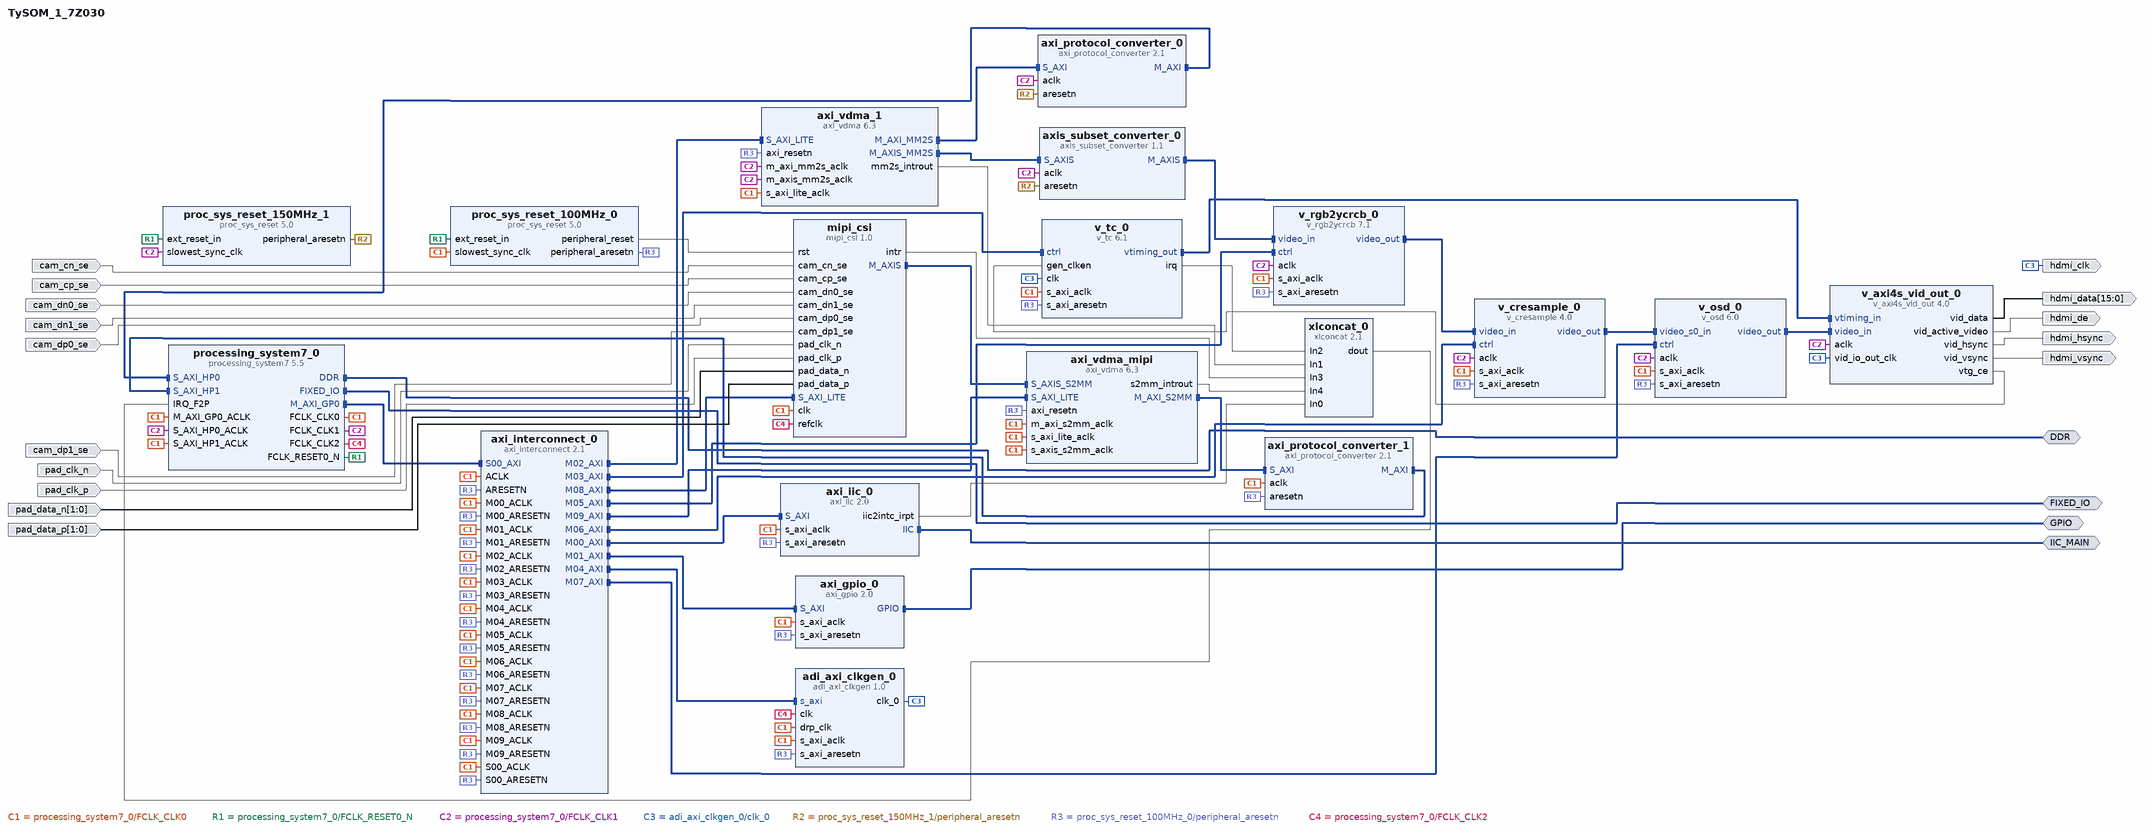
[diagram p0: block diagram of the top level]
# Vivado block design TySOM_1_7Z030, xc7z030fbg484-1, Vivado 2017.4
create_bd_design TySOM_1_7Z030

create_bd_intf_port -mode Master -vlnv xilinx.com:interface:ddrx_rtl:1.0 DDR
create_bd_intf_port -mode Master -vlnv xilinx.com:display_processing_system7:fixedio_rtl:1.0 FIXED_IO
create_bd_intf_port -mode Master -vlnv xilinx.com:interface:gpio_rtl:1.0 GPIO
create_bd_intf_port -mode Master -vlnv xilinx.com:interface:iic_rtl:1.0 IIC_MAIN
create_bd_port -dir O hdmi_clk
create_bd_port -dir I cam_cn_se
create_bd_port -dir I cam_cp_se
create_bd_port -dir I cam_dn0_se
create_bd_port -dir I cam_dn1_se
create_bd_port -dir I cam_dp0_se
create_bd_port -dir I cam_dp1_se
create_bd_port -dir I pad_clk_n
create_bd_port -dir I pad_clk_p
create_bd_port -dir I -from 1 -to 0 pad_data_n
create_bd_port -dir I -from 1 -to 0 pad_data_p
create_bd_port -dir O hdmi_de
create_bd_port -dir O -from 15 -to 0 hdmi_data
create_bd_port -dir O hdmi_hsync
create_bd_port -dir O hdmi_vsync

create_bd_cell -type ip -vlnv xilinx.com:ip:adi_axi_clkgen:1.0 adi_axi_clkgen_0
set_property -dict [list \
  CONFIG.PCORE_CLK1_DIV 6 \
  CONFIG.PCORE_CLK0_DIV 6 \
  CONFIG.PCORE_VCO_MUL 49 \
  CONFIG.PCORE_VCO_DIV 11 \
  CONFIG.PCORE_CLKIN_PERIOD 5 \
] [get_bd_cells adi_axi_clkgen_0]
create_bd_cell -type ip -vlnv smunaut:user:mipi_csi:1.0 mipi_csi
create_bd_cell -type ip -vlnv xilinx.com:ip:xlconcat:2.1 xlconcat_0
set_property -dict {CONFIG.NUM_PORTS 5 CONFIG.dout_width 5} [get_bd_cells xlconcat_0]
create_bd_cell -type ip -vlnv xilinx.com:ip:v_cresample:4.0 v_cresample_0
set_property -dict [list \
  CONFIG.has_axi4_lite true \
  CONFIG.s_axis_video_format 3 \
  CONFIG.m_axis_video_format 2 \
] [get_bd_cells v_cresample_0]
create_bd_cell -type ip -vlnv xilinx.com:ip:v_osd:6.0 v_osd_0
set_property -dict [list \
  CONFIG.SCREEN_WIDTH 1920 \
  CONFIG.M_AXIS_VIDEO_WIDTH 1920 \
  CONFIG.M_AXIS_VIDEO_HEIGHT 1080 \
  CONFIG.LAYER0_HORIZONTAL_START_POSITION 0 \
  CONFIG.LAYER0_WIDTH 1280 \
  CONFIG.LAYER0_HEIGHT 720 \
  CONFIG.LAYER1_HORIZONTAL_START_POSITION 0 \
  CONFIG.LAYER1_WIDTH 1280 \
  CONFIG.LAYER1_HEIGHT 720 \
  CONFIG.LAYER2_HORIZONTAL_START_POSITION 0 \
  CONFIG.LAYER2_WIDTH 1280 \
  CONFIG.LAYER2_HEIGHT 720 \
  CONFIG.LAYER3_HORIZONTAL_START_POSITION 0 \
  CONFIG.LAYER3_WIDTH 1280 \
  CONFIG.LAYER3_HEIGHT 720 \
  CONFIG.LAYER4_HORIZONTAL_START_POSITION 0 \
  CONFIG.LAYER4_WIDTH 1280 \
  CONFIG.LAYER4_HEIGHT 720 \
  CONFIG.LAYER5_HORIZONTAL_START_POSITION 0 \
  CONFIG.LAYER5_WIDTH 1280 \
  CONFIG.LAYER5_HEIGHT 720 \
  CONFIG.LAYER6_HORIZONTAL_START_POSITION 0 \
  CONFIG.LAYER6_WIDTH 1280 \
  CONFIG.LAYER6_HEIGHT 720 \
  CONFIG.LAYER7_HORIZONTAL_START_POSITION 0 \
  CONFIG.LAYER7_WIDTH 1280 \
  CONFIG.LAYER7_HEIGHT 720 \
] [get_bd_cells v_osd_0]
create_bd_cell -type ip -vlnv xilinx.com:ip:v_rgb2ycrcb:7.1 v_rgb2ycrcb_0
set_property -dict [list \
  CONFIG.HAS_AXI4_LITE true \
  CONFIG.Standard_Sel YUV \
  CONFIG.Output_Range 0_to_255_for_Computer_Graphics \
] [get_bd_cells v_rgb2ycrcb_0]
create_bd_cell -type ip -vlnv xilinx.com:ip:v_tc:6.1 v_tc_0
set_property -dict {CONFIG.VIDEO_MODE 1080p CONFIG.enable_detection false} [get_bd_cells v_tc_0]
create_bd_cell -type ip -vlnv xilinx.com:ip:axi_gpio:2.0 axi_gpio_0
set_property -dict {CONFIG.C_GPIO_WIDTH 2 CONFIG.C_ALL_OUTPUTS 1} [get_bd_cells axi_gpio_0]
create_bd_cell -type ip -vlnv xilinx.com:ip:axi_iic:2.0 axi_iic_0
create_bd_cell -type ip -vlnv xilinx.com:ip:axi_protocol_converter:2.1 axi_protocol_converter_0
create_bd_cell -type ip -vlnv xilinx.com:ip:axi_protocol_converter:2.1 axi_protocol_converter_1
set_property -dict {CONFIG.TRANSLATION_MODE 0 CONFIG.DATA_WIDTH 64} [get_bd_cells axi_protocol_converter_1]
create_bd_cell -type ip -vlnv xilinx.com:ip:axi_vdma:6.3 axi_vdma_1
set_property -dict {CONFIG.c_num_fstores 1 CONFIG.c_mm2s_linebuffer_depth 4096 CONFIG.c_include_s2mm 0} [get_bd_cells axi_vdma_1]
create_bd_cell -type ip -vlnv xilinx.com:ip:axi_vdma:6.3 axi_vdma_mipi
set_property -dict [list \
  CONFIG.c_m_axi_s2mm_data_width 64 \
  CONFIG.c_num_fstores 2 \
  CONFIG.c_s2mm_linebuffer_depth 4096 \
  CONFIG.c_include_mm2s 0 \
  CONFIG.c_s2mm_max_burst_length 16 \
] [get_bd_cells axi_vdma_mipi]
create_bd_cell -type ip -vlnv xilinx.com:ip:processing_system7:5.5 processing_system7_0
set_property -dict [list \
  CONFIG.PCW_FCLK_CLK1_BUF TRUE \
  CONFIG.PCW_FCLK_CLK2_BUF TRUE \
  CONFIG.PCW_UIPARAM_DDR_FREQ_MHZ 525 \
  CONFIG.PCW_CRYSTAL_PERIPHERAL_FREQMHZ 50 \
  CONFIG.PCW_APU_PERIPHERAL_FREQMHZ 650 \
  CONFIG.PCW_QSPI_PERIPHERAL_FREQMHZ 125 \
  CONFIG.PCW_SDIO_PERIPHERAL_FREQMHZ 50 \
  CONFIG.PCW_UART_PERIPHERAL_FREQMHZ 100 \
  CONFIG.PCW_I2C_PERIPHERAL_FREQMHZ 108.333336 \
  CONFIG.PCW_FPGA0_PERIPHERAL_FREQMHZ 100 \
  CONFIG.PCW_FPGA1_PERIPHERAL_FREQMHZ 150 \
  CONFIG.PCW_FPGA2_PERIPHERAL_FREQMHZ 200 \
  CONFIG.PCW_USE_S_AXI_HP0 1 \
  CONFIG.PCW_USE_S_AXI_HP1 1 \
  CONFIG.PCW_USE_FABRIC_INTERRUPT 1 \
  CONFIG.PCW_EN_CLK1_PORT 1 \
  CONFIG.PCW_EN_CLK2_PORT 1 \
  CONFIG.PCW_IRQ_F2P_INTR 1 \
  CONFIG.PCW_GP0_EN_MODIFIABLE_TXN 0 \
  CONFIG.PCW_GP1_EN_MODIFIABLE_TXN 0 \
  CONFIG.PCW_PERIPHERAL_BOARD_PRESET None \
  CONFIG.PCW_PRESET_BANK0_VOLTAGE {LVCMOS 1.8V} \
  CONFIG.PCW_PRESET_BANK1_VOLTAGE {LVCMOS 1.8V} \
  CONFIG.PCW_UIPARAM_DDR_BUS_WIDTH {16 Bit} \
  CONFIG.PCW_UIPARAM_DDR_PARTNO {MT41J256M8 HX-15E} \
  CONFIG.PCW_QSPI_PERIPHERAL_ENABLE 1 \
  CONFIG.PCW_QSPI_QSPI_IO {MIO 1 .. 6} \
  CONFIG.PCW_QSPI_GRP_SINGLE_SS_ENABLE 1 \
  CONFIG.PCW_QSPI_GRP_SINGLE_SS_IO {MIO 1 .. 6} \
  CONFIG.PCW_SINGLE_QSPI_DATA_MODE x4 \
  CONFIG.PCW_ENET0_PERIPHERAL_ENABLE 1 \
  CONFIG.PCW_ENET0_ENET0_IO {MIO 16 .. 27} \
  CONFIG.PCW_ENET0_GRP_MDIO_ENABLE 1 \
  CONFIG.PCW_ENET0_GRP_MDIO_IO {MIO 52 .. 53} \
  CONFIG.PCW_ENET_RESET_ENABLE 1 \
  CONFIG.PCW_ENET_RESET_SELECT {Share reset pin} \
  CONFIG.PCW_ENET0_RESET_ENABLE 1 \
  CONFIG.PCW_ENET0_RESET_IO {MIO 51} \
  CONFIG.PCW_SD0_PERIPHERAL_ENABLE 1 \
  CONFIG.PCW_SD0_SD0_IO {MIO 40 .. 45} \
  CONFIG.PCW_SD0_GRP_CD_ENABLE 1 \
  CONFIG.PCW_SD0_GRP_CD_IO EMIO \
  CONFIG.PCW_SD0_GRP_WP_ENABLE 1 \
  CONFIG.PCW_SD0_GRP_WP_IO EMIO \
  CONFIG.PCW_UART1_PERIPHERAL_ENABLE 1 \
  CONFIG.PCW_UART1_UART1_IO {MIO 12 .. 13} \
  CONFIG.PCW_TTC0_PERIPHERAL_ENABLE 1 \
  CONFIG.PCW_TTC0_TTC0_IO EMIO \
  CONFIG.PCW_USB0_PERIPHERAL_ENABLE 1 \
  CONFIG.PCW_USB0_USB0_IO {MIO 28 .. 39} \
  CONFIG.PCW_USB_RESET_ENABLE 1 \
  CONFIG.PCW_USB_RESET_SELECT {Share reset pin} \
  CONFIG.PCW_USB0_RESET_ENABLE 1 \
  CONFIG.PCW_USB0_RESET_IO {MIO 9} \
  CONFIG.PCW_I2C0_PERIPHERAL_ENABLE 1 \
  CONFIG.PCW_I2C0_I2C0_IO {MIO 14 .. 15} \
  CONFIG.PCW_I2C0_GRP_INT_ENABLE 0 \
  CONFIG.PCW_I2C_RESET_ENABLE 0 \
  CONFIG.PCW_GPIO_MIO_GPIO_ENABLE 1 \
  CONFIG.PCW_GPIO_MIO_GPIO_IO MIO \
  CONFIG.PCW_FCLK1_PERIPHERAL_CLKSRC {DDR PLL} \
  CONFIG.PCW_FPGA_FCLK1_ENABLE 1 \
  CONFIG.PCW_FPGA_FCLK2_ENABLE 1 \
] [get_bd_cells processing_system7_0]
# 507 more settings of processing_system7_0 are not shown: defaults, MIO pin electricals, DDR timing, and values the tool derives
create_bd_cell -type ip -vlnv xilinx.com:ip:v_axi4s_vid_out:4.0 v_axi4s_vid_out_0
set_property -dict [list \
  CONFIG.C_S_AXIS_VIDEO_FORMAT 0 \
  CONFIG.C_HAS_ASYNC_CLK 1 \
  CONFIG.C_VTG_MASTER_SLAVE 1 \
] [get_bd_cells v_axi4s_vid_out_0]
create_bd_cell -type ip -vlnv xilinx.com:ip:axi_interconnect:2.1 axi_interconnect_0
set_property -dict {CONFIG.NUM_MI 10 CONFIG.SYNCHRONIZATION_STAGES 2} [get_bd_cells axi_interconnect_0]
create_bd_cell -type ip -vlnv xilinx.com:ip:axis_subset_converter:1.1 axis_subset_converter_0
set_property -dict [list \
  CONFIG.S_TDATA_NUM_BYTES 4 \
  CONFIG.M_TDATA_NUM_BYTES 3 \
  CONFIG.S_TUSER_WIDTH 1 \
  CONFIG.M_TUSER_WIDTH 1 \
  CONFIG.S_HAS_TKEEP 1 \
  CONFIG.S_HAS_TLAST 1 \
  CONFIG.M_HAS_TKEEP 1 \
  CONFIG.M_HAS_TLAST 1 \
  CONFIG.TDATA_REMAP {tdata[23:16],tdata[7:0],tdata[15:8]} \
  CONFIG.TUSER_REMAP {tuser[0:0]} \
  CONFIG.TKEEP_REMAP {tkeep[2:0]} \
  CONFIG.TLAST_REMAP {tlast[0]} \
] [get_bd_cells axis_subset_converter_0]
create_bd_cell -type ip -vlnv xilinx.com:ip:proc_sys_reset:5.0 proc_sys_reset_100MHz_0
create_bd_cell -type ip -vlnv xilinx.com:ip:proc_sys_reset:5.0 proc_sys_reset_150MHz_1

# ---- connections ----

connect_bd_intf_net [get_bd_intf_pins axi_interconnect_0/M00_AXI] [get_bd_intf_pins axi_iic_0/S_AXI]
connect_bd_intf_net [get_bd_intf_pins axi_interconnect_0/M01_AXI] [get_bd_intf_pins axi_gpio_0/S_AXI]
connect_bd_intf_net [get_bd_intf_pins axi_interconnect_0/M02_AXI] [get_bd_intf_pins axi_vdma_1/S_AXI_LITE]
connect_bd_intf_net [get_bd_intf_pins axi_interconnect_0/M03_AXI] [get_bd_intf_pins v_tc_0/ctrl]
connect_bd_intf_net [get_bd_intf_pins axi_interconnect_0/M04_AXI] [get_bd_intf_pins adi_axi_clkgen_0/s_axi]
connect_bd_intf_net [get_bd_intf_pins axi_interconnect_0/M05_AXI] [get_bd_intf_pins v_rgb2ycrcb_0/ctrl]
connect_bd_intf_net [get_bd_intf_pins axi_interconnect_0/M06_AXI] [get_bd_intf_pins v_cresample_0/ctrl]
connect_bd_intf_net [get_bd_intf_pins axi_interconnect_0/M07_AXI] [get_bd_intf_pins v_osd_0/ctrl]
connect_bd_intf_net [get_bd_intf_pins axi_interconnect_0/M08_AXI] [get_bd_intf_pins mipi_csi/S_AXI_LITE]
connect_bd_intf_net [get_bd_intf_pins axi_vdma_mipi/S_AXI_LITE] [get_bd_intf_pins axi_interconnect_0/M09_AXI]
connect_bd_intf_net [get_bd_intf_pins processing_system7_0/S_AXI_HP0] [get_bd_intf_pins axi_protocol_converter_0/M_AXI]
connect_bd_intf_net [get_bd_intf_pins processing_system7_0/S_AXI_HP1] [get_bd_intf_pins axi_protocol_converter_1/M_AXI]
connect_bd_intf_net -intf_net axi_vdma_0_M_AXI_S2MM [get_bd_intf_pins axi_protocol_converter_1/S_AXI] [get_bd_intf_pins axi_vdma_mipi/M_AXI_S2MM]
connect_bd_intf_net [get_bd_intf_pins axi_vdma_1/M_AXIS_MM2S] [get_bd_intf_pins axis_subset_converter_0/S_AXIS]
connect_bd_intf_net [get_bd_intf_pins axi_protocol_converter_0/S_AXI] [get_bd_intf_pins axi_vdma_1/M_AXI_MM2S]
connect_bd_intf_net [get_bd_intf_pins axis_subset_converter_0/M_AXIS] [get_bd_intf_pins v_rgb2ycrcb_0/video_in]
connect_bd_intf_net -intf_net mipi_csi_0_M_AXIS [get_bd_intf_pins axi_vdma_mipi/S_AXIS_S2MM] [get_bd_intf_pins mipi_csi/M_AXIS]
connect_bd_intf_net [get_bd_intf_pins processing_system7_0/M_AXI_GP0] [get_bd_intf_pins axi_interconnect_0/S00_AXI]
connect_bd_intf_net [get_bd_intf_pins v_cresample_0/video_out] [get_bd_intf_pins v_osd_0/video_s0_in]
connect_bd_intf_net [get_bd_intf_pins v_osd_0/video_out] [get_bd_intf_pins v_axi4s_vid_out_0/video_in]
connect_bd_intf_net [get_bd_intf_pins v_rgb2ycrcb_0/video_out] [get_bd_intf_pins v_cresample_0/video_in]
connect_bd_intf_net [get_bd_intf_pins v_tc_0/vtiming_out] [get_bd_intf_pins v_axi4s_vid_out_0/vtiming_in]
connect_bd_intf_net [get_bd_intf_ports DDR] [get_bd_intf_pins processing_system7_0/DDR]
connect_bd_intf_net [get_bd_intf_ports FIXED_IO] [get_bd_intf_pins processing_system7_0/FIXED_IO]
connect_bd_intf_net [get_bd_intf_ports GPIO] [get_bd_intf_pins axi_gpio_0/GPIO]
connect_bd_intf_net [get_bd_intf_ports IIC_MAIN] [get_bd_intf_pins axi_iic_0/IIC]
connect_bd_net [get_bd_pins processing_system7_0/FCLK_CLK0] \
  [get_bd_pins mipi_csi/clk] [get_bd_pins adi_axi_clkgen_0/s_axi_aclk] [get_bd_pins adi_axi_clkgen_0/drp_clk] \
  [get_bd_pins v_cresample_0/s_axi_aclk] [get_bd_pins v_osd_0/s_axi_aclk] [get_bd_pins v_rgb2ycrcb_0/s_axi_aclk] \
  [get_bd_pins v_tc_0/s_axi_aclk] [get_bd_pins axi_gpio_0/s_axi_aclk] [get_bd_pins axi_iic_0/s_axi_aclk] \
  [get_bd_pins axi_protocol_converter_1/aclk] [get_bd_pins axi_vdma_1/s_axi_lite_aclk] \
  [get_bd_pins axi_vdma_mipi/s_axi_lite_aclk] [get_bd_pins axi_vdma_mipi/m_axi_s2mm_aclk] \
  [get_bd_pins axi_vdma_mipi/s_axis_s2mm_aclk] [get_bd_pins processing_system7_0/M_AXI_GP0_ACLK] \
  [get_bd_pins processing_system7_0/S_AXI_HP1_ACLK] [get_bd_pins axi_interconnect_0/ACLK] \
  [get_bd_pins axi_interconnect_0/S00_ACLK] [get_bd_pins axi_interconnect_0/M00_ACLK] \
  [get_bd_pins axi_interconnect_0/M01_ACLK] [get_bd_pins axi_interconnect_0/M02_ACLK] \
  [get_bd_pins axi_interconnect_0/M03_ACLK] [get_bd_pins axi_interconnect_0/M04_ACLK] \
  [get_bd_pins axi_interconnect_0/M05_ACLK] [get_bd_pins axi_interconnect_0/M06_ACLK] \
  [get_bd_pins axi_interconnect_0/M07_ACLK] [get_bd_pins axi_interconnect_0/M08_ACLK] \
  [get_bd_pins axi_interconnect_0/M09_ACLK] [get_bd_pins proc_sys_reset_100MHz_0/slowest_sync_clk]
connect_bd_net [get_bd_pins processing_system7_0/FCLK_RESET0_N] \
  [get_bd_pins proc_sys_reset_100MHz_0/ext_reset_in] [get_bd_pins proc_sys_reset_150MHz_1/ext_reset_in]
connect_bd_net [get_bd_pins processing_system7_0/FCLK_CLK1] \
  [get_bd_pins v_cresample_0/aclk] [get_bd_pins v_osd_0/aclk] [get_bd_pins v_rgb2ycrcb_0/aclk] \
  [get_bd_pins axi_protocol_converter_0/aclk] [get_bd_pins axi_vdma_1/m_axi_mm2s_aclk] \
  [get_bd_pins axi_vdma_1/m_axis_mm2s_aclk] [get_bd_pins processing_system7_0/S_AXI_HP0_ACLK] \
  [get_bd_pins v_axi4s_vid_out_0/aclk] [get_bd_pins axis_subset_converter_0/aclk] \
  [get_bd_pins proc_sys_reset_150MHz_1/slowest_sync_clk]
connect_bd_net [get_bd_pins adi_axi_clkgen_0/clk_0] [get_bd_ports hdmi_clk] [get_bd_pins v_tc_0/clk] [get_bd_pins v_axi4s_vid_out_0/vid_io_out_clk]
connect_bd_net [get_bd_pins axi_iic_0/iic2intc_irpt] [get_bd_pins xlconcat_0/In0]
connect_bd_net [get_bd_pins axi_vdma_1/mm2s_introut] [get_bd_pins xlconcat_0/In1]
connect_bd_net [get_bd_pins axi_vdma_mipi/s2mm_introut] [get_bd_pins xlconcat_0/In4]
connect_bd_net [get_bd_ports cam_cn_se] [get_bd_pins mipi_csi/cam_cn_se]
connect_bd_net [get_bd_ports cam_cp_se] [get_bd_pins mipi_csi/cam_cp_se]
connect_bd_net [get_bd_ports cam_dn0_se] [get_bd_pins mipi_csi/cam_dn0_se]
connect_bd_net [get_bd_ports cam_dn1_se] [get_bd_pins mipi_csi/cam_dn1_se]
connect_bd_net [get_bd_ports cam_dp0_se] [get_bd_pins mipi_csi/cam_dp0_se]
connect_bd_net [get_bd_ports cam_dp1_se] [get_bd_pins mipi_csi/cam_dp1_se]
connect_bd_net -net mipi_csi_0_intr [get_bd_pins mipi_csi/intr] [get_bd_pins xlconcat_0/In3]
connect_bd_net [get_bd_ports pad_clk_n] [get_bd_pins mipi_csi/pad_clk_n]
connect_bd_net [get_bd_ports pad_clk_p] [get_bd_pins mipi_csi/pad_clk_p]
connect_bd_net [get_bd_ports pad_data_n] [get_bd_pins mipi_csi/pad_data_n]
connect_bd_net [get_bd_ports pad_data_p] [get_bd_pins mipi_csi/pad_data_p]
connect_bd_net -net proc_sys_reset_0_peripheral_aresetn [get_bd_pins proc_sys_reset_150MHz_1/peripheral_aresetn] \
  [get_bd_pins axi_protocol_converter_0/aresetn] [get_bd_pins axis_subset_converter_0/aresetn]
connect_bd_net [get_bd_pins proc_sys_reset_100MHz_0/peripheral_aresetn] \
  [get_bd_pins adi_axi_clkgen_0/s_axi_aresetn] [get_bd_pins v_cresample_0/s_axi_aresetn] [get_bd_pins v_osd_0/s_axi_aresetn] \
  [get_bd_pins v_rgb2ycrcb_0/s_axi_aresetn] [get_bd_pins v_tc_0/s_axi_aresetn] [get_bd_pins axi_gpio_0/s_axi_aresetn] \
  [get_bd_pins axi_iic_0/s_axi_aresetn] [get_bd_pins axi_protocol_converter_1/aresetn] [get_bd_pins axi_vdma_1/axi_resetn] \
  [get_bd_pins axi_vdma_mipi/axi_resetn] [get_bd_pins axi_interconnect_0/ARESETN] \
  [get_bd_pins axi_interconnect_0/S00_ARESETN] [get_bd_pins axi_interconnect_0/M00_ARESETN] \
  [get_bd_pins axi_interconnect_0/M01_ARESETN] [get_bd_pins axi_interconnect_0/M02_ARESETN] \
  [get_bd_pins axi_interconnect_0/M03_ARESETN] [get_bd_pins axi_interconnect_0/M04_ARESETN] \
  [get_bd_pins axi_interconnect_0/M05_ARESETN] [get_bd_pins axi_interconnect_0/M06_ARESETN] \
  [get_bd_pins axi_interconnect_0/M07_ARESETN] [get_bd_pins axi_interconnect_0/M08_ARESETN] \
  [get_bd_pins axi_interconnect_0/M09_ARESETN]
connect_bd_net [get_bd_pins proc_sys_reset_100MHz_0/peripheral_reset] [get_bd_pins mipi_csi/rst]
connect_bd_net [get_bd_pins processing_system7_0/FCLK_CLK2] [get_bd_pins mipi_csi/refclk] [get_bd_pins adi_axi_clkgen_0/clk]
connect_bd_net [get_bd_pins v_axi4s_vid_out_0/vid_active_video] [get_bd_ports hdmi_de]
connect_bd_net [get_bd_pins v_axi4s_vid_out_0/vid_data] [get_bd_ports hdmi_data]
connect_bd_net [get_bd_pins v_axi4s_vid_out_0/vid_hsync] [get_bd_ports hdmi_hsync]
connect_bd_net [get_bd_pins v_axi4s_vid_out_0/vid_vsync] [get_bd_ports hdmi_vsync]
connect_bd_net [get_bd_pins v_axi4s_vid_out_0/vtg_ce] [get_bd_pins v_tc_0/gen_clken]
connect_bd_net [get_bd_pins v_tc_0/irq] [get_bd_pins xlconcat_0/In2]
connect_bd_net [get_bd_pins xlconcat_0/dout] [get_bd_pins processing_system7_0/IRQ_F2P]

# ---- address map ----
assign_bd_address -offset 0x00000000 -range 512M -target_address_space [get_bd_addr_spaces axi_vdma_1/Data_MM2S] [get_bd_addr_segs processing_system7_0/S_AXI_HP0/HP0_DDR_LOWOCM]
assign_bd_address -offset 0x00000000 -range 512M -target_address_space [get_bd_addr_spaces axi_vdma_mipi/Data_S2MM] [get_bd_addr_segs processing_system7_0/S_AXI_HP1/HP1_DDR_LOWOCM]
assign_bd_address -offset 0x41200000 -range 64K -target_address_space [get_bd_addr_spaces processing_system7_0/Data] [get_bd_addr_segs axi_gpio_0/S_AXI/Reg]
assign_bd_address -offset 0x41600000 -range 64K -target_address_space [get_bd_addr_spaces processing_system7_0/Data] [get_bd_addr_segs axi_iic_0/S_AXI/Reg]
assign_bd_address -offset 0x43000000 -range 64K -target_address_space [get_bd_addr_spaces processing_system7_0/Data] [get_bd_addr_segs axi_vdma_1/S_AXI_LITE/Reg]
assign_bd_address -offset 0x43010000 -range 64K -target_address_space [get_bd_addr_spaces processing_system7_0/Data] [get_bd_addr_segs axi_vdma_mipi/S_AXI_LITE/Reg]
assign_bd_address -offset 0x43C00000 -range 64K -target_address_space [get_bd_addr_spaces processing_system7_0/Data] [get_bd_addr_segs v_tc_0/ctrl/Reg]
assign_bd_address -offset 0x43C10000 -range 64K -target_address_space [get_bd_addr_spaces processing_system7_0/Data] [get_bd_addr_segs v_rgb2ycrcb_0/ctrl/Reg]
assign_bd_address -offset 0x43C20000 -range 64K -target_address_space [get_bd_addr_spaces processing_system7_0/Data] [get_bd_addr_segs v_cresample_0/ctrl/Reg]
assign_bd_address -offset 0x43C30000 -range 64K -target_address_space [get_bd_addr_spaces processing_system7_0/Data] [get_bd_addr_segs v_osd_0/ctrl/Reg]
assign_bd_address -offset 0x43C40000 -range 64K -target_address_space [get_bd_addr_spaces processing_system7_0/Data] [get_bd_addr_segs mipi_csi/S_AXI_LITE/reg0]
assign_bd_address -offset 0x43D00000 -range 64K -target_address_space [get_bd_addr_spaces processing_system7_0/Data] [get_bd_addr_segs adi_axi_clkgen_0/s_axi/reg0]

validate_bd_design
save_bd_design
